# EAGLE design dram_arduino_adapter (EAGLE 9.2.1)
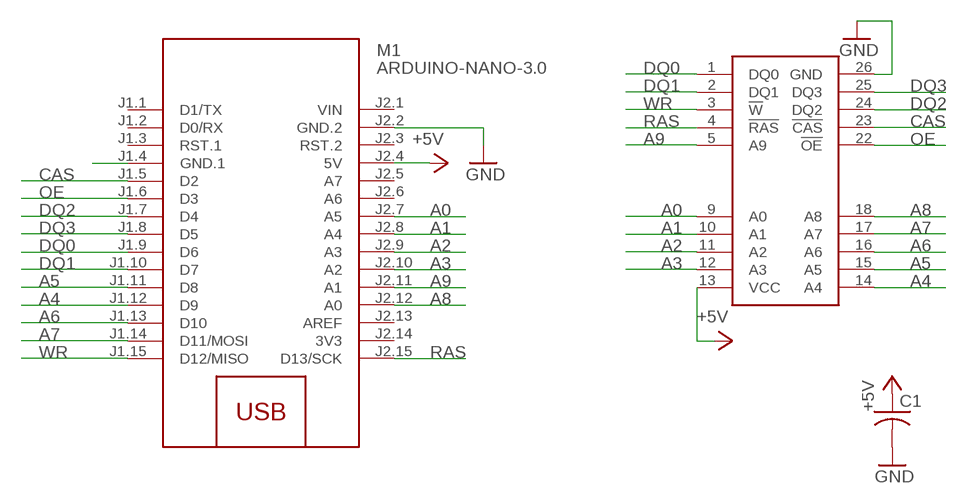
[diagram p0: schematic, sheet 1]

## Parts
C1  C-USC1206  [C1206]
M1  ARDUINO-NANO-3.0  [ARDUINO-NANO-3.0]
U$1  HY514400A  [HY514400A]

## Nets
+5V: C1.1 M1.J2.4(5V) U$1.13(VCC)
A0: M1.J2.7(A5) U$1.9(A0)
A1: M1.J2.8(A4) U$1.10(A1)
A2: M1.J2.9(A3) U$1.11(A2)
A3: M1.J2.10(A2) U$1.12(A3)
A4: M1.J1.12(D9) U$1.14(A4)
A5: M1.J1.11(D8) U$1.15(A5)
A6: M1.J1.13(D10) U$1.16(A6)
A7: M1.J1.14(D11/MOSI) U$1.17(A7)
A8: M1.J2.12(A0) U$1.18(A8)
A9: M1.J2.11(A1) U$1.5(A9)
CAS: M1.J1.5(D2) U$1.23(!CAS!)
DQ0: M1.J1.9(D6) U$1.1(DQ0)
DQ1: M1.J1.10(D7) U$1.2(DQ1)
DQ2: M1.J1.7(D4) U$1.24(DQ2)
DQ3: M1.J1.8(D5) U$1.25(DQ3)
GND: C1.2 M1.J2.2(GND.2) U$1.26(GND)
N$1: M1.J1.4(GND.1)
OE: M1.J1.6(D3) U$1.22(!OE!)
RAS: M1.J2.15(D13/SCK) U$1.4(!RAS!)
WR: M1.J1.15(D12/MISO) U$1.3(!W!)
Unconnected: M1.J1.1(D1/TX) M1.J1.2(D0/RX) M1.J1.3(RST.1) M1.J2.3(RST.2) M1.J2.5(A7) M1.J2.6(A6) M1.J2.13(AREF)

## Power pins joined to a net without a drawn wire
3V3: M1.J2.14(3V3)
VIN: M1.J2.1(VIN)

## Library data of the parts
C1 = rcl:C-US: CAPACITOR, American symbol; SPICEPREFIX: C
M1 = diy-modules:ARDUINO-NANO-3.0: Arduino Nano 3.0 and compatible devices More details available here: https://www.arduino.cc/en/Main/ArduinoBoardNano Click here to find device on ebay.com <http://www.ebay.com/sch/arduino+nano>
U$1 = HY514400A:HY514400A

## Board
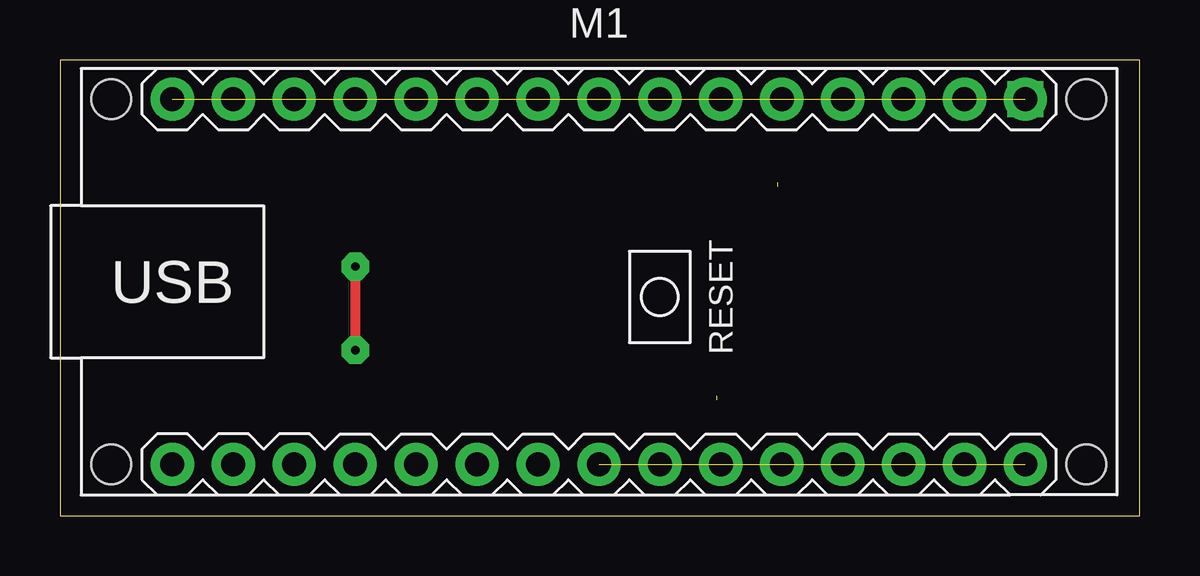
[diagram p1: board, top side]
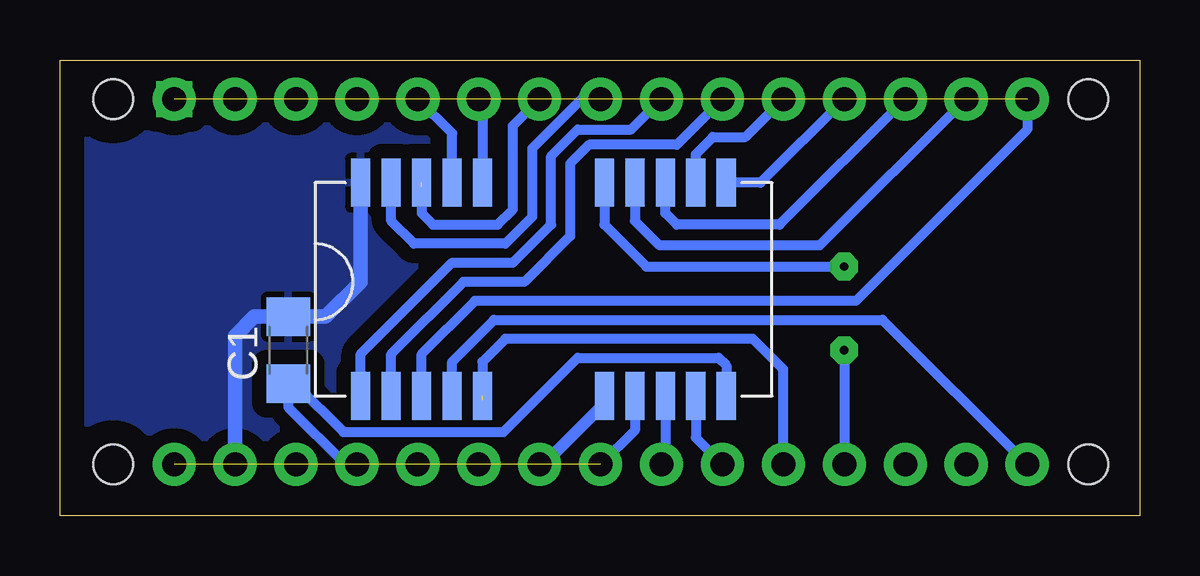
[diagram p2: board, bottom side, seen from below]

Size 45 x 19 mm. Coordinates in mm from the lower left corner, seen from the top.
Outline: 0,0 45,0 45,19 0,19 0,0
Copper layers (1*16): Top 0.035mm / dielectric 1.5mm / Bottom 0.035mm
Design rules "default": minimum track width 6mil, minimum drill 0.35mm, track to track 6mil, track to pad 6mil, pad to pad 6mil, via to via 6mil, smd to smd 6mil, copper to edge 40mil, drill to drill 6mil, minimum pad ring 10mil, minimum via ring 8mil, stop-mask expansion 4mil, vias tented up to drill 0mil, thermal gap 10mil

### Footprints (pad centres in the part's own frame; a part is rotated, then mirrored left to right if it is on the bottom)
C1206 = smd 1.6 x 1.8: 1 -1.4,0; 2 1.4,0
ARDUINO-NANO-3.0 = drill 1 square: J1.1 17.78,7.62 | drill 1: J1.2 15.24,7.62; J1.3 12.7,7.62; J1.4 10.16,7.62; J1.5 7.62,7.62; J1.6 5.08,7.62; J1.7 2.54,7.62; J1.8 0,7.62; J1.9 -2.54,7.62; J1.10 -5.08,7.62; J1.11 -7.62,7.62; J1.12 -10.16,7.62; J1.13 -12.7,7.62; J1.14 -15.24,7.62; J1.15 -17.78,7.62; J2.1 17.78,-7.62; J2.2 15.24,-7.62; J2.3 12.7,-7.62; J2.4 10.16,-7.62; J2.5 7.62,-7.62; J2.6 5.08,-7.62; J2.7 2.54,-7.62; J2.8 0,-7.62; J2.9 -2.54,-7.62; J2.10 -5.08,-7.62; J2.11 -7.62,-7.62; J2.12 -10.16,-7.62; J2.13 -12.7,-7.62; J2.14 -15.24,-7.62; J2.15 -17.78,-7.62 | hole 1.651: -20.32,7.62; -20.32,-7.62; 20.32,-7.62; 20.32,7.62
HY514400A = smd 0.8 x 2: 1 -6.35,-4.445; 2 -5.08,-4.445; 3 -3.81,-4.445; 4 -2.54,-4.445; 5 -1.27,-4.445; 9 3.81,-4.445; 10 5.08,-4.445; 11 6.35,-4.445; 12 7.62,-4.445; 13 8.89,-4.445; 14 8.89,4.445; 15 7.62,4.445; 16 6.35,4.445; 17 5.08,4.445; 18 3.81,4.445; 22 -1.27,4.445; 23 -2.54,4.445; 24 -3.81,4.445; 25 -5.08,4.445; 26 -6.35,4.445

### Placement (x,y rotation side)
C1  35.48,6.89 90 bottom
M1  22.47,9.75 0 top
U$1  26.12,9.43 0 bottom

### Tracks (layer width: path | path; a pad name or v marks a point on that pad's centre or on a via)
+5V
  Bottom 0.406: 32.62,2.45 M1.J2.4 33.1,2.13 35.48,4.51 C1.1 35.48,5.62 35.32,5.78 | 35.19,5.49 33.18,3.48 26.51,3.48 23.42,6.57 17.54,6.57 17.23,6.26 U$1.13
  Bottom 0.508: C1.1 35.19,5.49
A0
  Bottom 0.508: U$1.9 22.31,4.67 24.85,2.13 M1.J2.7
A1
  Bottom 0.406: U$1.10 21.04,3.56 M1.J2.8
A2
  Bottom 0.406: U$1.11 19.77,2.29 M1.J2.9
A3
  Bottom 0.406: U$1.12 18.5,3.24 M1.J2.10
A4
  Bottom 0.406: M1.J1.12 15.8,13.88 U$1.14
A5
  Bottom 0.406: U$1.15 18.5,15.07 17.78,15.78 16.43,15.78 M1.J1.11
A6
  Bottom 0.406: M1.J1.13 15,12.13 19.29,12.13 19.77,12.61 U$1.16
A7
  Bottom 0.406: U$1.17 21.04,12.29 20.01,11.26 13.33,11.26 M1.J1.14
A8  (via drill 0.35 pad 1.15)
  Top 0.406: v12.3,10.38 v12.3,6.89
  Bottom 0.406: v12.3,6.89 M1.J2.12 | v12.3,10.38 20.56,10.38 22.31,12.13 U$1.18
A9  (1 unrouted)
  Bottom 0.406: M1.J2.11 14.84,6.1 16.11,7.37 26.43,7.37 27.39,6.42 27.39,4.83
CAS
  Bottom 0.406: U$1.23 28.66,15.94 M1.J1.5
DQ0
  Bottom 0.406: M1.J1.9 21.2,16.1 23.42,16.1 24.53,14.99 24.53,12.13 26.12,10.54 28.66,10.54 32.47,6.73 U$1.1
DQ1
  Bottom 0.406: U$1.2 31.2,6.73 28.18,9.75 25.64,9.75 23.73,11.66 23.73,14.67 22.94,15.47 19.29,15.47 M1.J1.10
DQ2  (1 unrouted)
  Bottom 0.406: 29.93,13.72 29.93,12.61 29.45,12.13 26.75,12.13 26.12,12.77 26.12,16.26 M1.J1.7
DQ3
  Bottom 0.406: M1.J1.8 23.26,17.37 25.32,15.31 25.32,12.45 26.43,11.34 30.24,11.34 31.2,12.29 U$1.25
GND
  Bottom 0.61: M1.J2.2 37.7,7.5 36.91,8.29 C1.2 33.92,8.29 32.47,9.75 U$1.26
  pour Bottom (isolate 0.61): 0,20 46,20 46,-1 -1,-1 -1,20
N$2  (via drill 0.6 pad 1.8)
  other vias: 4.68,2.13
N$3  (via drill 0.6 pad 1.8)
  other vias: 7.23,2.13
N$4  (via drill 0.6 pad 1.8)
  other vias: 9.77,2.13
N$5  (via drill 0.6 pad 1.8)
  other vias: 12.3,2.13
N$6  (via drill 0.6 pad 1.8)
  other vias: 14.84,2.13
N$7  (via drill 0.6 pad 1.8)
  other vias: 17.38,2.13
N$8  (via drill 0.6 pad 1.8)
  other vias: 19.92,2.13
N$9  (via drill 0.6 pad 1.8)  (7 unrouted)
  other vias: 22.47,2.13 25.01,2.13 27.55,2.13 30.09,2.13 32.62,2.13 35.16,2.13 37.7,2.13 40.24,2.13
N$10  (via drill 0.6 pad 1.8)  (7 unrouted)
  other vias: 22.47,17.37 25.01,17.37 27.55,17.37 30.09,17.37 32.62,17.37 35.16,17.37 37.7,17.37 40.24,17.37
N$11  (via drill 0.6 pad 1.8)  (7 unrouted)
  other vias: 4.68,17.37 7.23,17.37 9.77,17.37 12.3,17.37 14.84,17.37 17.38,17.37 19.92,17.37 22.47,17.37
OE
  Bottom 0.406: M1.J1.6 27.39,17.21 U$1.22
RAS
  Bottom 0.406: U$1.4 28.66,6.42 26.91,8.16 10.72,8.16 M1.J2.15
WR
  Bottom 0.406: U$1.3 29.93,6.73 27.7,8.96 11.83,8.96 4.68,16.1 M1.J1.15